# Altium schematic sheet 6_DIG.SchDoc: AX301  Http://www.heijin.org
size OrCAD B; DocumentNumber: 6; SheetNumber: 6; SheetTotal: 7; PageSetup: Record=PageOptions|CenterHorizontal=True|CenterVertical=True|PrintScale=0.75|XCorrection=1.00|YCorrection=1.00|PrintKind=0|BorderSize=5000000|LeftOffset=0|BottomOffset=0|Orientation=2|PaperLength=1000|PaperWidth=1000|Scale=100|PaperSource=7|PrintQuality=-4|MediaType=1|DitherType=10|PrintScaleMode=1|PaperKind=A4|PaperIndex=9
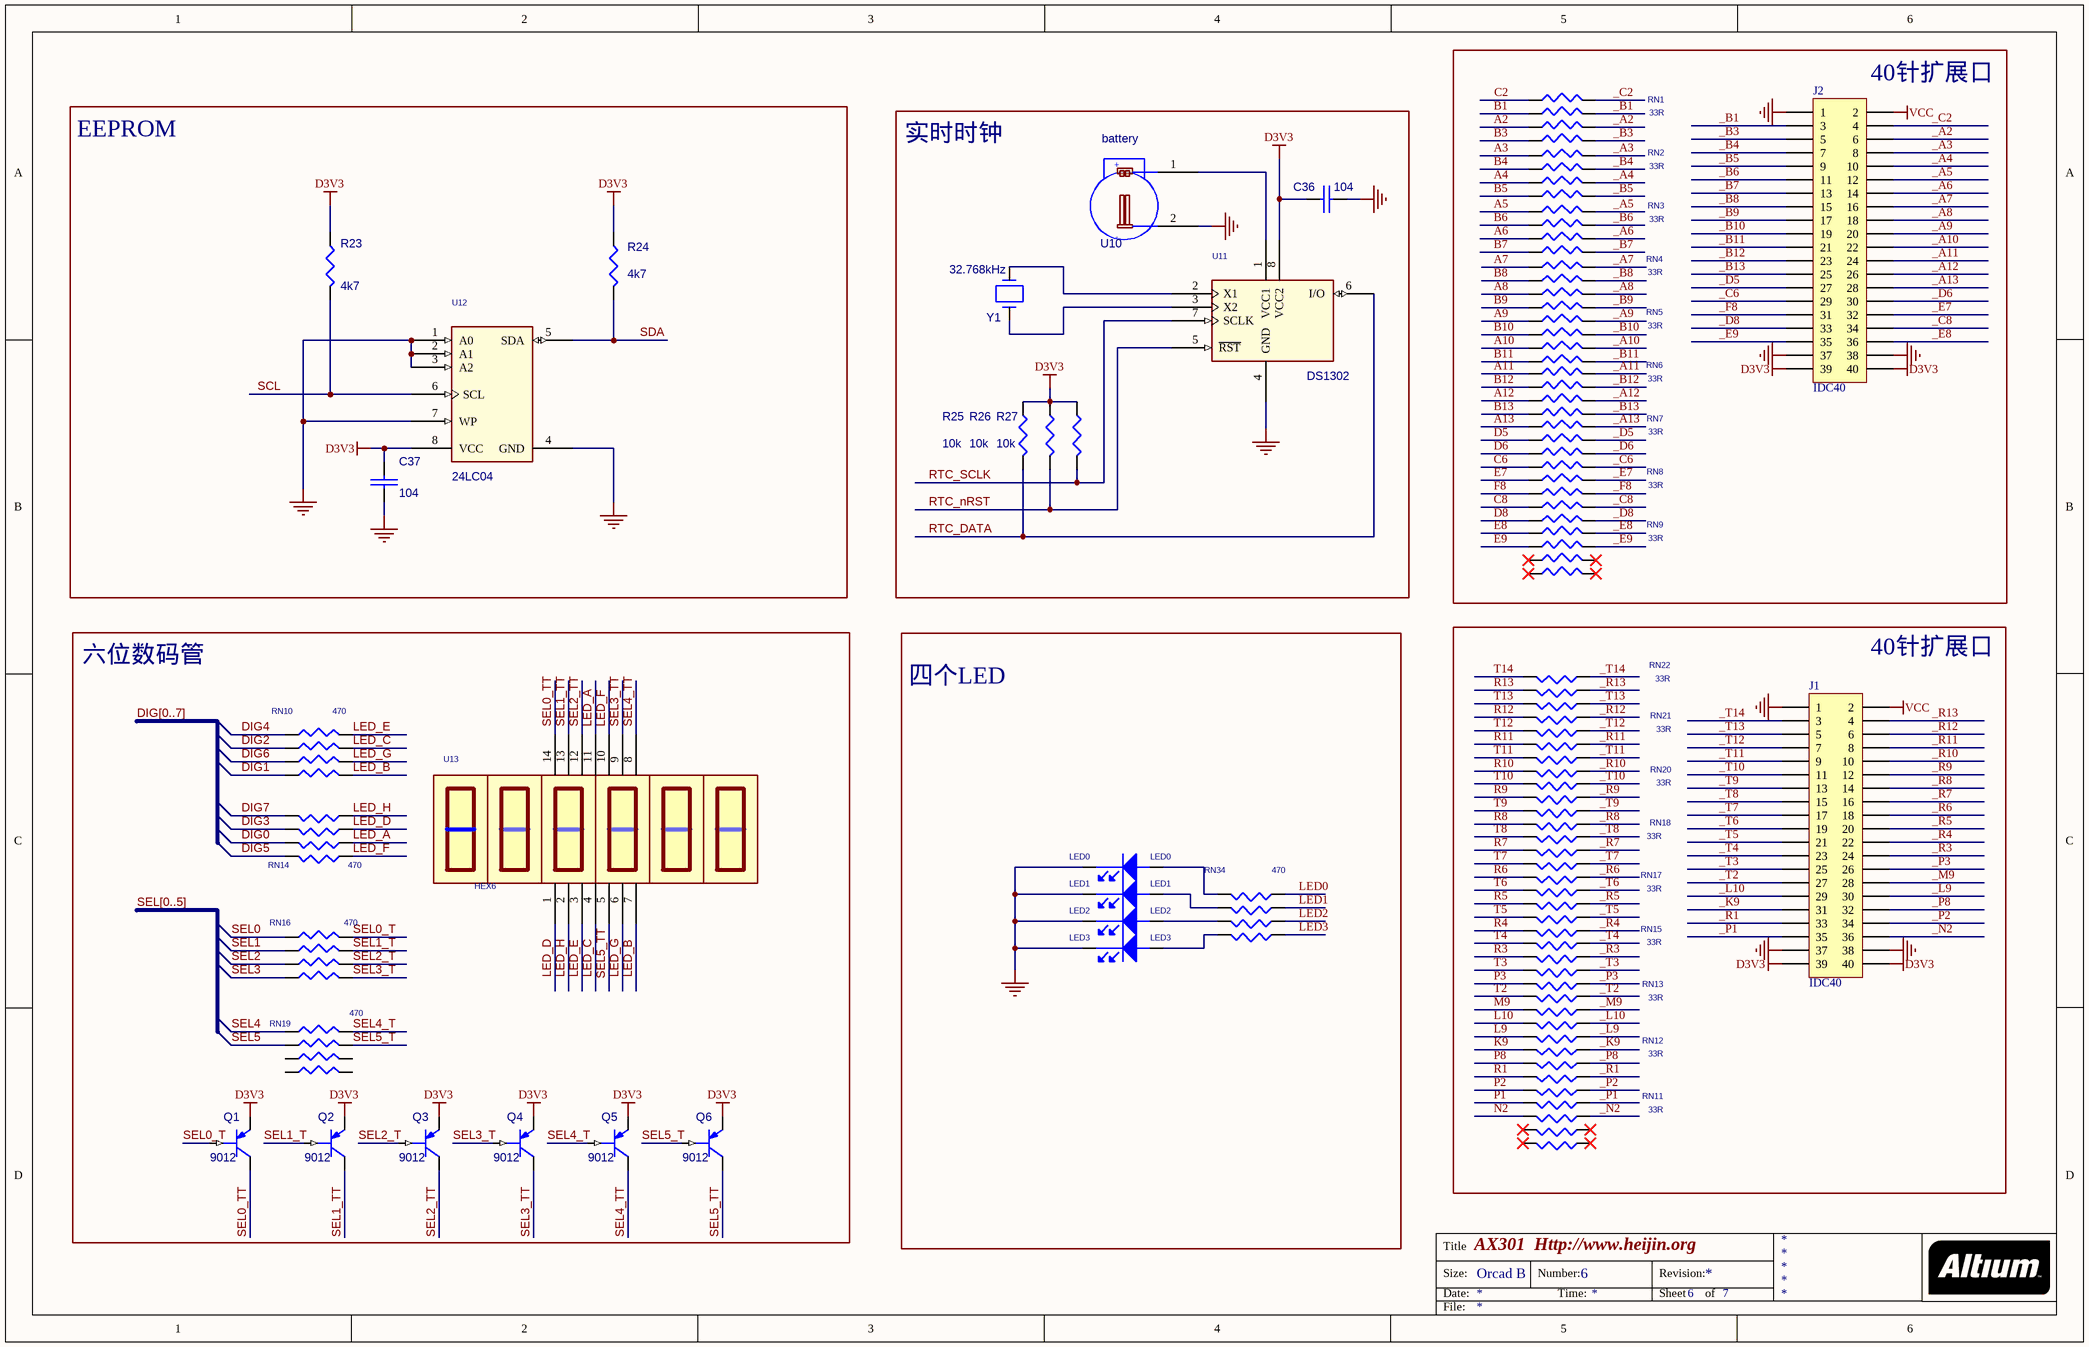
[diagram p0: 6_DIG.SchDoc]

## Parts
C36  104  [0402]
C37  104  [0402]
J1  IDC40  [IDC-40J]
J2  IDC40  [IDC-40J]
LED0  LED0  [LEDSO]
LED1  LED1  [LEDso]
LED2  LED2  [LEDSO]
LED3  LED3  [LEDSO]
Q1  9012  [SOT23]
Q2  9012  [SOT23]
Q3  9012  [SOT23]
Q4  9012  [SOT23]
Q5  9012  [SOT23]
Q6  9012  [SOT23]
R23  4k7  [0603]
R24  4k7  [0603]
R25  10k  [0603]
R26  10k  [0603]
R27  10k  [0603]
RN1  33R  [RN-8P]
RN2  33R  [RN-8P]
RN3  33R  [RN-8P]
RN4  33R  [RN-8P]
RN5  33R  [RN-8P]
RN6  33R  [RN-8P]
RN7  33R  [RN-8P]
RN8  33R  [RN-8P]
RN9  33R  [RN-8P]
RN10  470  [RN-8P]
RN11  33R  [RN-8P]
RN12  33R  [RN-8P]
RN13  33R  [RN-8P]
RN14  470  [RN-8P]
RN15  33R  [RN-8P]
RN16  470  [RN-8P]
RN17  33R  [RN-8P]
RN18  33R  [RN-8P]
RN19  470  [RN-8P]
RN20  33R  [RN-8P]
RN21  33R  [RN-8P]
RN22  33R  [RN-8P]
RN34  470  [RN-8P]
U10  battery  [BATSO]
U11  DS1302  [SO8]
U12  24LC04  [SO8]
U13  HEX6  [NIX_6]
Y1  32.768kHz  [CY_SMALL]

## Blocks framed on the sheet
40针扩展口: J2 RN1-RN9
EEPROM: C37 R23 R24 U12
实时时钟: C36 R25-R27 U10 U11 Y1
六位数码管: Q1-Q6 RN10 RN14 RN16 RN19 U13
四个LED: LED0-LED3 RN34
40针扩展口: J1 RN11-RN13 RN15 RN17 RN18 RN20-RN22

## Nets
D3V3: C36.1 C37.1 J1.39 J1.40 J2.39 J2.40 Q1.2(EMITTER) Q2.2(EMITTER) Q3.2(EMITTER) Q4.2(EMITTER) Q5.2(EMITTER) Q6.2(EMITTER) R23.1 R24.1 R25.1 R26.1 R27.1 U11.8(VCC2) U12.8(VCC)
GND: C36.2 C37.2 J1.1 J1.37 J1.38 J2.1 J2.37 J2.38 LED0.2(CATHODE) LED1.2(CATHODE) LED2.2(CATHODE) LED3.2(CATHODE) U10.2(GND) U11.4(GND) U12.1(A0) U12.2(A1) U12.3(A2) U12.4(GND) U12.7(WP)
VCC: J1.2 J2.2
_A2: J2.6 RN1.6
_A3: J2.8 RN2.8
_A4: J2.10 RN2.6
_A5: J2.12 RN3.8
_A6: J2.14 RN3.6
_A7: J2.16 RN4.8
_A8: J2.18 RN4.6
_A9: J2.20 RN5.8
_A10: J2.22 RN5.6
_A11: J2.24 RN6.8
_A12: J2.26 RN6.6
_A13: J2.28 RN7.8
_B1: J2.3 RN1.7
_B3: J2.5 RN1.5
_B4: J2.7 RN2.7
_B5: J2.9 RN2.5
_B6: J2.11 RN3.7
_B7: J2.13 RN3.5
_B8: J2.15 RN4.7
_B9: J2.17 RN4.5
_B10: J2.19 RN5.7
_B11: J2.21 RN5.5
_B12: J2.23 RN6.7
_B13: J2.25 RN6.5
_C2: J2.4 RN1.8
_C6: J2.29 RN7.5
_C8: J2.34 RN8.6
_D5: J2.27 RN7.7
_D6: J2.30 RN7.6
_D8: J2.33 RN8.5
_E7: J2.32 RN8.8
_E8: J2.36 RN9.8
_E9: J2.35 RN9.7
_F8: J2.31 RN8.7
_K9: J1.31 RN12.4
_L9: J1.30 RN13.1
_L10: J1.29 RN13.2
_M9: J1.28 RN13.3
_N2: J1.36 RN11.3
_P1: J1.35 RN11.4
_P2: J1.34 RN12.1
_P3: J1.26 RN15.1
_P8: J1.32 RN12.3
_R1: J1.33 RN12.2
_R3: J1.24 RN15.3
_R4: J1.22 RN17.1
_R5: J1.20 RN17.3
_R6: J1.18 RN18.1
_R7: J1.16 RN18.3
_R8: J1.14 RN20.1
_R9: J1.12 RN20.3
_R10: J1.10 RN21.1
_R11: J1.8 RN21.3
_R12: J1.6 RN22.1
_R13: J1.4 RN22.3
_T2: J1.27 RN13.4
_T3: J1.25 RN15.2
_T4: J1.23 RN15.4
_T5: J1.21 RN17.2
_T6: J1.19 RN17.4
_T7: J1.17 RN18.2
_T8: J1.15 RN18.4
_T9: J1.13 RN20.2
_T10: J1.11 RN20.4
_T11: J1.9 RN21.2
_T12: J1.7 RN21.4
_T13: J1.5 RN22.2
_T14: J1.3 RN22.4
A2: RN1.3
A3: RN2.1
A4: RN2.3
A5: RN3.1
A6: RN3.3
A7: RN4.1
A8: RN4.3
A9: RN5.1
A10: RN5.3
A11: RN6.1
A12: RN6.3
A13: RN7.1
B1: RN1.2
B3: RN1.4
B4: RN2.2
B5: RN2.4
B6: RN3.2
B7: RN3.4
B8: RN4.2
B9: RN4.4
B10: RN5.2
B11: RN5.4
B12: RN6.2
B13: RN6.4
C2: RN1.1
C6: RN7.4
C8: RN8.3
D5: RN7.2
D6: RN7.3
D8: RN8.4
DIG0: RN14.7
DIG1: RN10.5
DIG2: RN10.7
DIG3: RN14.6
DIG4: RN10.8
DIG5: RN14.8
DIG6: RN10.6
DIG7: RN14.5
E7: RN8.1
E8: RN9.1
E9: RN9.2
F8: RN8.2
K9: RN12.5
L9: RN13.8
L10: RN13.7
LED0: RN34.4
LED1: RN34.3
LED2: RN34.2
LED3: RN34.1
LED_A: RN14.2 U13.11
LED_B: RN10.4 U13.7
LED_C: RN10.2 U13.4
LED_D: RN14.3 U13.1
LED_E: RN10.1 U13.3
LED_F: RN14.1 U13.10
LED_G: RN10.3 U13.6
LED_H: RN14.4 U13.2
M9: RN13.6
N2: RN11.6
P1: RN11.5
P2: RN12.8
P3: RN15.8
P8: RN12.6
R1: RN12.7
R3: RN15.6
R4: RN17.8
R5: RN17.6
R6: RN18.8
R7: RN18.6
R8: RN20.8
R9: RN20.6
R10: RN21.8
R11: RN21.6
R12: RN22.8
R13: RN22.6
RTC_DATA: R25.2 U11.6(I/O)
RTC_nRST: R26.2 U11.5(~{RST})
RTC_SCLK: R27.2 U11.7(SCLK)
SCL: R23.2 U12.6(SCL)
SDA: R24.2 U12.5(SDA)
SEL0: RN16.8
SEL0_T: Q1.1(BASE) RN16.1
SEL0_TT: Q1.3(COLLECTOR) U13.14
SEL1: RN16.7
SEL1_T: Q2.1(BASE) RN16.2
SEL1_TT: Q2.3(COLLECTOR) U13.13
SEL2: RN16.6
SEL2_T: Q3.1(BASE) RN16.3
SEL2_TT: Q3.3(COLLECTOR) U13.12
SEL3: RN16.5
SEL3_T: Q4.1(BASE) RN16.4
SEL3_TT: Q4.3(COLLECTOR) U13.9
SEL4: RN19.8
SEL4_T: Q5.1(BASE) RN19.1
SEL4_TT: Q5.3(COLLECTOR) U13.8
SEL5: RN19.7
SEL5_T: Q6.1(BASE) RN19.2
SEL5_TT: Q6.3(COLLECTOR) U13.5
T2: RN13.5
T3: RN15.7
T4: RN15.5
T5: RN17.7
T6: RN17.5
T7: RN18.7
T8: RN18.5
T9: RN20.7
T10: RN20.5
T11: RN21.7
T12: RN21.5
T13: RN22.7
T14: RN22.5
NetLED0_1: LED0.1(ANODE) RN34.5
NetLED1_1: LED1.1(ANODE) RN34.6
NetLED2_1: LED2.1(ANODE) RN34.7
NetLED3_1: LED3.1(ANODE) RN34.8
NetU10_1: U10.1(VBAT) U11.1(VCC1)
NetU11_2: U11.2(X1) Y1.1
NetU11_3: U11.3(X2) Y1.2

Not connected (* = marked no-connect by the designer): RN9 3* 4* 5* 6*; RN11 1* 2* 7* 8*; RN19 3 4 5 6

## Buses and harness runs
bus DIG[0..7]
bus SEL[0..5]

## Notes on the sheet
- Title
- Size:
- Date:
- Orcad B
- Number:
- Time:
- Revision:
- Sheet
- of
- File:
- (in symbol battery) +; -

## Library data of the parts
C36 = C_Dup3
C37 = C_Dup4
J1 J2 = MHDR2X20: Header, 20-Pin, Dual row; LatestRevisionDate: 17-Jul-2002; LatestRevisionNote: Re-released for DXP Platform.; Publisher: Altium Limited
LED0-LED3 = LED_Dup1
Q1-Q6 = PNP
R23 R24 = R_Dup6
R25-R27 = R_Dup5
RN1-RN9 RN11-RN13 RN15 RN17 RN18 RN20-RN22 = RN_Dup1
RN10 RN14 RN16 RN19 RN34 = RN
U11 = DS1302_8SO: Part Number: TMP-13; ICA_PARTNUM: $$2098133$$DS1302S; ICA_MFR_NAME: MAXIM INTEGRATED PRODUCTS INC
U12 = 24LC04B_0
Y1 = ZTA